# EAGLE design pro-micro-screw-terminal-v1.0 (EAGLE 9.6.2)
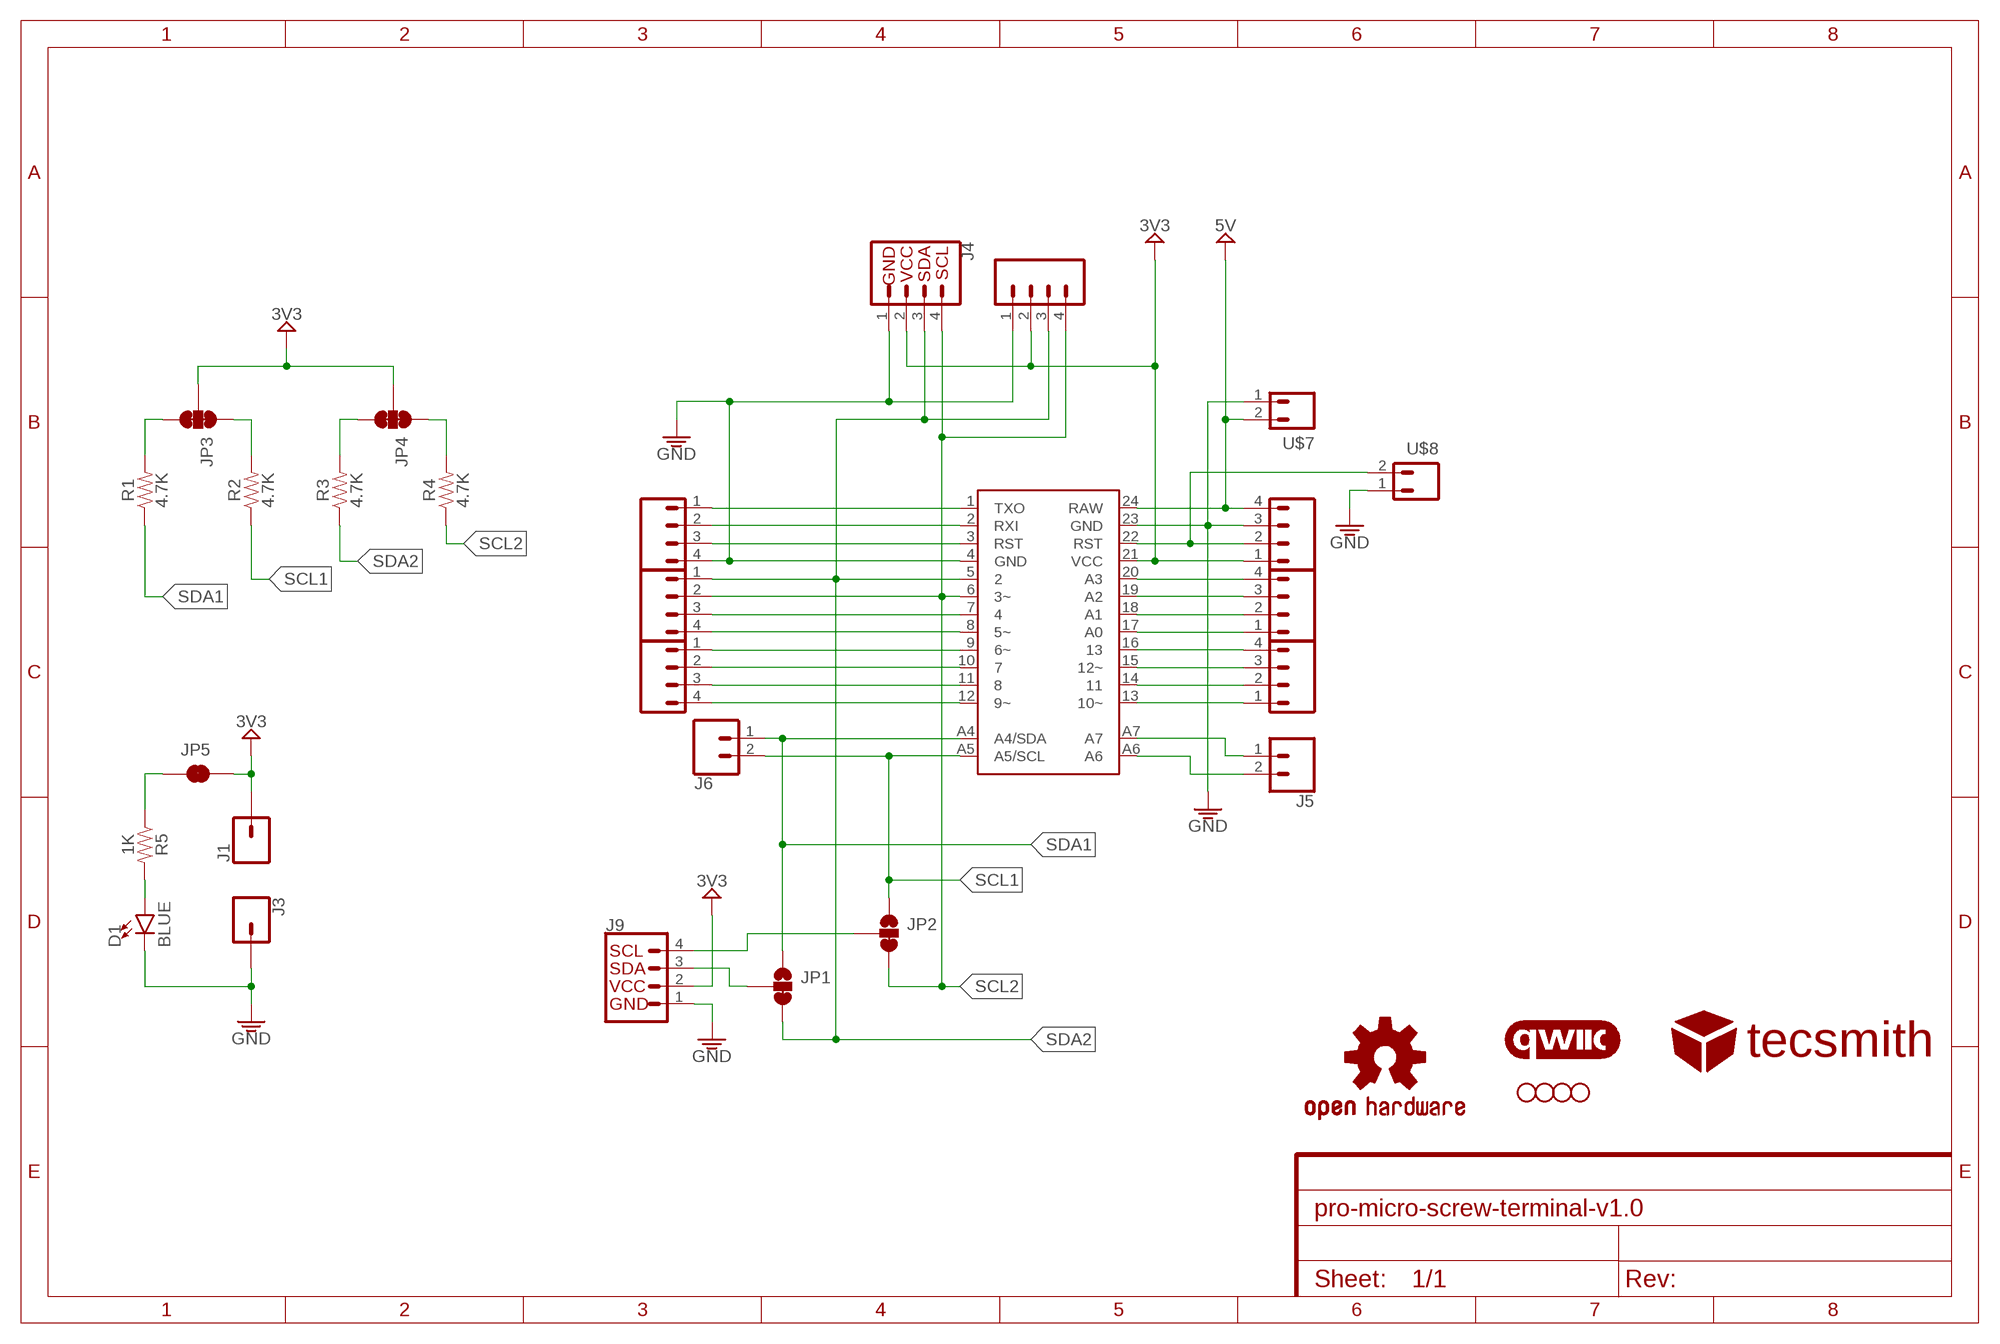
[diagram p0: schematic, sheet 1]

## Parts
B1  ARDUINO_PRO_MININO_FTDI  [ARDUINO_PRO_MINI]
D1  BLUE  LED-BLUE0603  [LED-0603]
H1  STAND-OFF  [STAND-OFF]
H2  STAND-OFF  [STAND-OFF]
H5  STAND-OFF  [STAND-OFF]
H6  STAND-OFF  [STAND-OFF]
J1  CONN_01PTH_NO_SILK_YES_STOP  [1X01_NO_SILK]
J2  CONN_04PTH  [1X04]
J3  CONN_01PTH_NO_SILK_YES_STOP  [1X01_NO_SILK]
J4  QWIIC_RIGHT_ANGLE  QWIIC_CONNECTORJS-1MM  [JST04_1MM_RA]
J5  CONN_02  [1X02]
J6  CONN_02  [1X02]
J9  QWIIC_RIGHT_ANGLE  QWIIC_CONNECTORJS-1MM  [JST04_1MM_RA]
JP1  JUMPER-SMT_3_1-NC_TRACE_SILK  [SMT-JUMPER_3_1-NC_TRACE_SILK]
JP2  JUMPER-SMT_3_1-NC_TRACE_SILK  [SMT-JUMPER_3_1-NC_TRACE_SILK]
JP3  JUMPER-SMT_3_2-NC_TRACE_SILK  [SMT-JUMPER_3_2-NC_TRACE_SILK]
JP4  JUMPER-SMT_3_2-NC_TRACE_SILK  [SMT-JUMPER_3_2-NC_TRACE_SILK]
JP5  JUMPER-SMT_2_NC_TRACE_SILK  [SMT-JUMPER_2_NC_TRACE_SILK]
LOGO1  OSHW-LOGOS  [OSHW-LOGO-S]
LOGO2  QWIIC_LOGO_6MM  [QWIIC_6MM]
R1  4.7K  RESISTOR0805  [0805]
R2  4.7K  RESISTOR0805  [0805]
R3  4.7K  RESISTOR0805  [0805]
R4  4.7K  RESISTOR0805  [0805]
R5  1K  330OHM-0603-1/10W-1%  [0603]
U$1  CON_04SCREW  [WURTH_2431_3.5MM_4X_SCREW]
U$2  CON_04SCREW  [WURTH_2431_3.5MM_4X_SCREW]
U$3  CON_04SCREW  [WURTH_2431_3.5MM_4X_SCREW]
U$4  CON_04SCREW  [WURTH_2431_3.5MM_4X_SCREW]
U$5  CON_04SCREW  [WURTH_2431_3.5MM_4X_SCREW]
U$6  CON_04SCREW  [WURTH_2431_3.5MM_4X_SCREW]
U$7  CON_02SCREW  [WURTH_2431_3.5MM_2X_SCREW]
U$8  JST-PH-2NS  [JST-PH2-NO-SILK]
U$9  TECSMITH-LOGO  [TECSMITH-LOGO]

## Nets
GND: B1.4(GND) B1.23(GND) D1.C J2.1 J3.1 J4.1 J9.1 U$1.4 U$6.3 U$7.1 U$8.1
N$1: B1.1(TXO) U$1.1
N$2: B1.2(RXI) U$1.2
N$3: B1.3(RST) U$1.3
N$4: B1.A7 J5.1
N$5: B1.A6 J5.2
N$6: D1.A R5.2
N$7: B1.7 U$2.3
N$8: B1.8(5~) U$2.4
N$9: B1.9(6~) U$3.1
N$10: B1.10 U$3.2
N$11: B1.11 U$3.3
N$12: B1.12(9~) U$3.4
N$13: JP5.1 R5.1
N$15: B1.22(RST) U$6.2 U$8.2
N$16: JP3.1 R2.2
N$17: B1.20(A3) U$5.4
N$18: B1.19(A2) U$5.3
N$19: B1.18(A1) U$5.2
N$20: B1.17(A0) U$5.1
N$21: B1.16 U$4.4
N$22: B1.15(12~) U$4.3
N$23: B1.14 U$4.2
N$24: B1.13(10~) U$4.1
N$25: JP3.3 R1.2
N$26: JP4.3 R3.2
N$27: JP4.1 R4.2
RAW: B1.24(RAW) U$6.4 U$7.2 ; supply symbol labelled 5V
SCL: J9.4 JP2.2
SCL1: B1.A5(A5/SCL) J6.2 JP2.1 R2.1
SCL2: B1.6(3~) J2.4 J4.4 JP2.3 R4.1 U$2.2
SDA: J9.3 JP1.2
SDA1: B1.A4(A4/SDA) J6.1 JP1.1 R1.1
SDA2: B1.5 J2.3 J4.3 JP1.3 R3.1 U$2.1
VCC: B1.21(VCC) J1.1 J2.2 J4.2 J9.2 JP3.2 JP4.2 JP5.2 U$6.1 ; supply symbol labelled 3V3

## Library data of the parts
B1 = VinoRodrigues_Custom_Eagle:ARDUINO_PRO_MINI: SparkFun Pro Mini Pro Mini compatible footprint. Dimensions: 0.7 x 1.3" PCB Thickness: 0.8mm SparkFun Products: 3.3V/8MHz <https://www.sparkfun.com/products/11114> 5V/16MHz <https://www.sparkfun.com/products/11113>
D1 = SparkFun-LED:LED-BLUE: Blue SMD LED Used in manufacturing of various products at SparkFun Packages: 0603 - SMD 0603 package [Product Link] <http://www.digikey.com/product-detail/en/SMLE12BC7TT86/511-1589-2-ND/1641808> 1206 - SMD1206 package [Product Link] <http://www.digikey.com/product-detail/en/lite-on-inc/LTST-C150TBKT/160-1643-1-ND/573584> SparkFun Products: ESP8266 Thing-Dev Board <https://www.sparkfun.com/products/13711> RedBoard <https://www.sparkfun.com/products/12757>; PROD_ID: DIO-08575
H1 H2 H5 H6 = SparkFun-Hardware:STAND-OFF: Stand Off Drill holes for mechanically mounting via screws, standoffs, etc. Note: Use the keepout ring to avoid running the screw head into surrounding components. Variant Overviews STAND-OFF - Mechanical footprint for a #4 phillips button head screw. STAND-OFF-TIGHT - Mechanical footprint for a #4 phillips button head screw, Example SparkFun Products Screw - Phillips Head (1/4", 4-40, 10 pack) <https://www.sparkfun.com/products/10453> (PRT-10453) Screw - Phillips Head (1/2", 4-40, 10 pack) <https://www.sparkfun.com/products/10452> (PRT-10452) Screw - Phillips Head (3/4", 4-40, 10 pack) <https://www.sparkfun.com/products/10451> (PRT-10451) Screw - Phillips Head (1", 4-40, 10 pack) <https://www.sparkfun.com/products/10450> (PRT-10450)
J1 J3 = SparkFun-Connectors:CONN_01: Single connection point. Often used as Generic Header-pin footprint for 0.1 inch spaced/style header connections On any of the 0.1 inch spaced packages, you can populate with these: Break Away Headers - Straight <https://www.sparkfun.com/products/116> (PRT-00116) Break Away Male Headers - Right Angle <https://www.sparkfun.com/products/553> (PRT-00553) Female Headers <https://www.sparkfun.com/products/115> (PRT-00115) Break Away Headers - Machine Pin <https://www.sparkfun.com/products/117> (PRT-00117) Break Away Female Headers - Swiss Machine Pin <https://www.sparkfun.com/products/743> (PRT-00743) This device is also useful as a general connection point to wire up your design to another part of your project. Our various solder wires solder well into these plated through hole pads. Hook-Up Wire - Assortment (Stranded, 22 AWG) <https://www.sparkfun.com/products/11375> (PRT-11375) Hook-Up Wire - Assortment (Solid Core, 22 AWG) <https://www.sparkfun.com/products/11367> (PRT-11367) View the entire wire category on our website here <https://www.sparkfun.com/categories/141> Special notes: SMTSO-256-ET is a "flush mount" nut for a 4-40 screw. We mostly use this on specialty testbeds; it is a nice way to connect hardware to your PCB at an adjustable hieght. Also note, the SNAP packages are for using a snappable style connector. We sell a baggie of snaps and they are also used on two LilyPad designs: Snap Assortment - 30 pack (male and female) <https://www.sparkfun.com/products/11347> (DEV-11347) LilyPad Arduino SimpleSnap <https://www.sparkfun.com/products/10941> (DEV-10941) LilyPad SimpleSnap Protoboard <https://www.sparkfun.com/products/10940> (DEV-10940)
J2 = SparkFun-Connectors:CONN_04: Multi connection point. Often used as Generic Header-pin footprint for 0.1 inch spaced/style header connections On any of the 0.1 inch spaced packages, you can populate with these: Break Away Headers - Straight <https://www.sparkfun.com/products/116> (PRT-00116) Break Away Male Headers - Right Angle <https://www.sparkfun.com/products/553> (PRT-00553) Female Headers <https://www.sparkfun.com/products/115> (PRT-00115) Break Away Headers - Machine Pin <https://www.sparkfun.com/products/117> (PRT-00117) Break Away Female Headers - Swiss Machine Pin <https://www.sparkfun.com/products/743> (PRT-00743) For SCREWTERMINALS and SPRING TERMINALS visit here: Screw Terimnals on SparkFun.com <https://www.sparkfun.com/search/results?term=Screw+Terminals> (5mm/3.5mm/2.54mm spacing) This device is also useful as a general connection point to wire up your design to another part of your project. Our various solder wires solder well into these plated through hole pads. Hook-Up Wire - Assortment (Stranded, 22 AWG) <https://www.sparkfun.com/products/11375> (PRT-11375) Hook-Up Wire - Assortment (Solid Core, 22 AWG) <https://www.sparkfun.com/products/11367> (PRT-11367) View the entire wire category on our website here <https://www.sparkfun.com/categories/141> Special notes: Molex polarized connector foot print use with SKU : PRT-08231 with associated crimp pins and housings. 1MM SMD Version SKU: PRT-10208; PROD_ID: CONN-09696
J4 J9 = SparkFun-Connectors:QWIIC_CONNECTOR: SparkFun I2C Standard Qwiic Connector An SMD 1mm pitch JST connector makes it easy and quick (get it? Qwiic?) to connect I2C devices to each other. The Qwiic system <http://www.sparkfun.com/qwiic> enables fast and solderless connection between popular platforms and various sensors and actuators. We carry 200mm <https://www.sparkfun.com/products/14204>, 100mm <https://www.sparkfun.com/products/14205>, 50mm <https://www.sparkfun.com/products/14206>, and breadboard friendly <https://www.sparkfun.com/products/14207> Qwiic cables. We also offer 10 pcs strips <https://www.sparkfun.com/products/14323> the SMD connectors.; PROD_ID: CONN-13694
J5 J6 = SparkFun-Connectors:CONN_02: Multi connection point. Often used as Generic Header-pin footprint for 0.1 inch spaced/style header connections On any of the 0.1 inch spaced packages, you can populate with these: Break Away Headers - Straight <https://www.sparkfun.com/products/116> (PRT-00116) Break Away Male Headers - Right Angle <https://www.sparkfun.com/products/553> (PRT-00553) Female Headers <https://www.sparkfun.com/products/115> (PRT-00115) Break Away Headers - Machine Pin <https://www.sparkfun.com/products/117> (PRT-00117) Break Away Female Headers - Swiss Machine Pin <https://www.sparkfun.com/products/743> (PRT-00743) For SCREWTERMINALS and SPRING TERMINALS visit here: Screw Terimnals on SparkFun.com <https://www.sparkfun.com/search/results?term=Screw+Terminals> (5mm/3.5mm/2.54mm spacing) This device is also useful as a general connection point to wire up your design to another part of your project. Our various solder wires solder well into these plated through hole pads. Hook-Up Wire - Assortment (Stranded, 22 AWG) <https://www.sparkfun.com/products/11375> (PRT-11375) Hook-Up Wire - Assortment (Solid Core, 22 AWG) <https://www.sparkfun.com/products/11367> (PRT-11367) View the entire wire category on our website here <https://www.sparkfun.com/categories/141> Special notes: Molex polarized connector foot print use with: PRT-08233 with associated crimp pins and housings. 2.54_SCREWTERM for use with PRT-10571. 3.5mm Screw Terminal footprints for PRT-08084 5mm Screw Terminal footprints for use with PRT-08432
JP1 JP2 = SparkFun-Jumpers:JUMPER-SMT_3_1-NC_TRACE: Normally closed trace jumper (1 of 2 connections) This jumper has a trace between two pads so it's normally closed (NC). The other connection is normally open (NO). Use a razor knife to open the connection. For best results follow the IPC guidelines for cutting traces: Cutout at least 0.063 mm (0.005 in). Remove all loose material to clean up the cut area. Seal the cut with an approved epoxy. Reapply solder to reclose the connection, or to close the NO connection.
JP3 JP4 = SparkFun-Jumpers:JUMPER-SMT_3_2-NC_TRACE: Normally closed trace jumper (2 of 2 connections) This jumper has a trace between all three pads so they are normally closed (NC). Use a razor knife to open the connection(s). For best results follow the IPC guidelines for cutting traces: Cutout at least 0.063 mm (0.005 in). Remove all loose material to clean up the cut area. Seal the cut with an approved epoxy. Reapply solder to reclose the connection(s).
JP5 = SparkFun-Jumpers:JUMPER-SMT_2_NC_TRACE: Normally closed trace jumper This jumper has a trace between two pads so it's normally closed (NC). Use a razor knife to open the connection. For best results follow the IPC guidelines for cutting traces: Cutout at least 0.063 mm (0.005 in). Remove all loose material to clean up the cut area. Seal the cut with an approved epoxy. Reapply solder to reclose the connection.
LOGO1 = SparkFun-Aesthetics:OSHW-LOGO: Open-Source Hardware (OSHW) Logo This logo indicates the piece of hardware it is found on incorporates a OSHW license and/or adheres to the definition of open source hardware found here: http://freedomdefined.org/OSHW
LOGO2 = SparkFun-Aesthetics:QWIIC_LOGO: Qwiic Logos for placement on schematic and PCB. The 5.5mm silk logo is best for placing next to Qwiic connector.
R1-R4 = SparkFun-Resistors:RESISTOR: Generic Resistor Package
R5 = SparkFun-Resistors:330OHM: 330Ω resistor A resistor is a passive two-terminal electrical component that implements electrical resistance as a circuit element. Resistors act to reduce current flow, and, at the same time, act to lower voltage levels within circuits. - Wikipedia; PROD_ID: RES-00818; VALUE: 330
U$1-U$6 = VinoRodrigues_Custom_Eagle:CON_04SCREW
U$7 = VinoRodrigues_Custom_Eagle:CON_02SCREW
U$8 = VinoRodrigues_Custom_Eagle:JST-PH-2
U$9 = VinoRodrigues_Custom_Eagle:TECSMITH-LOGO

## Board
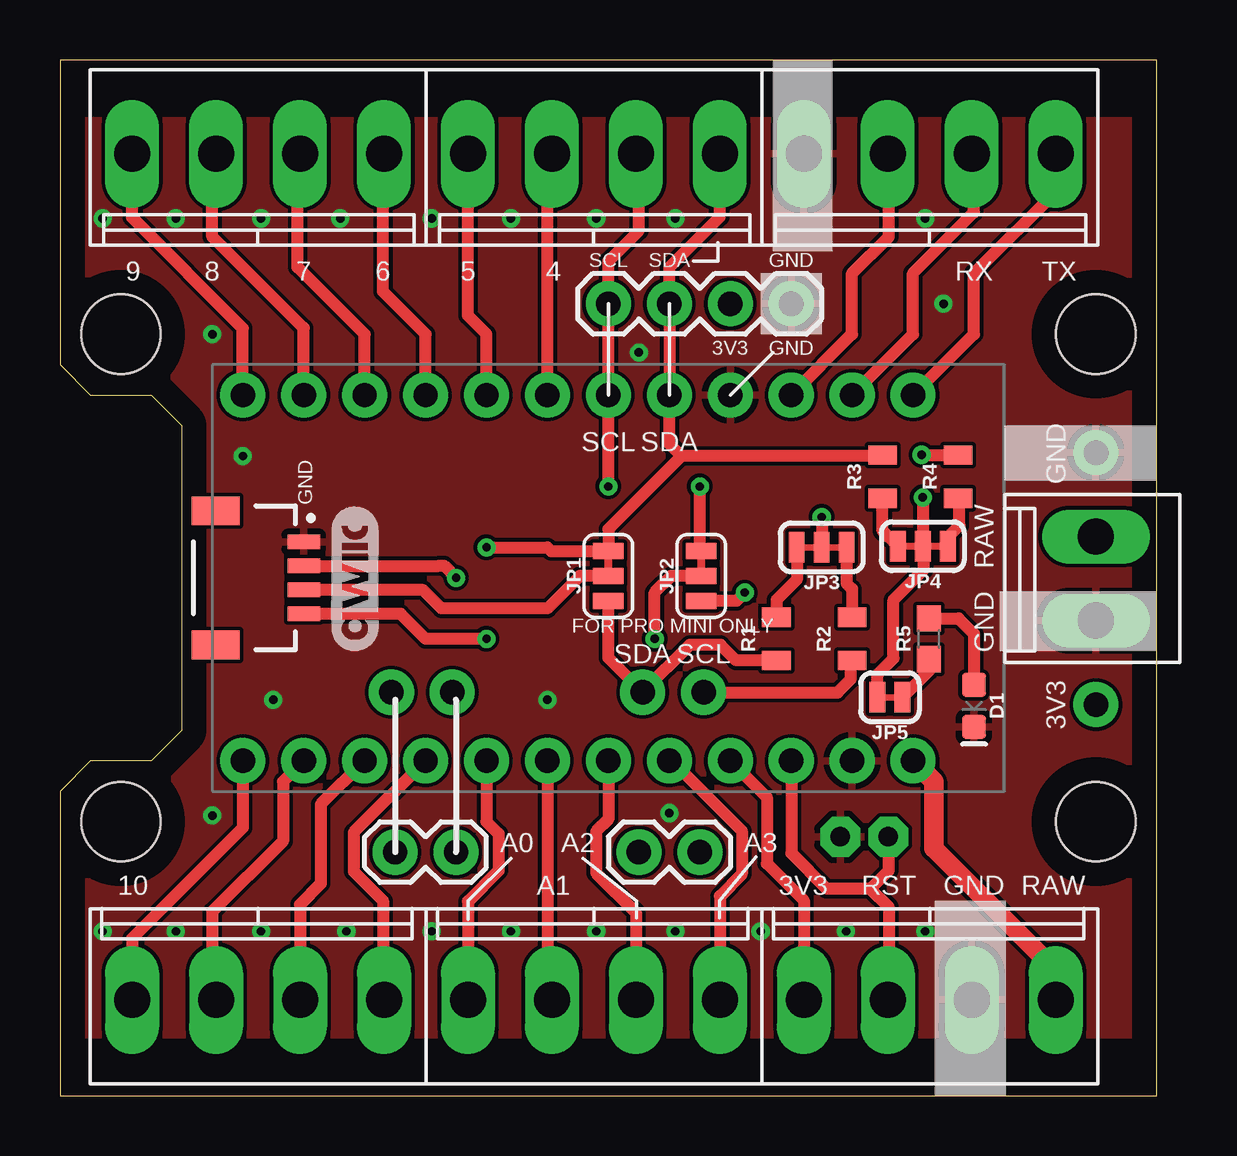
[diagram p1: board, top side]
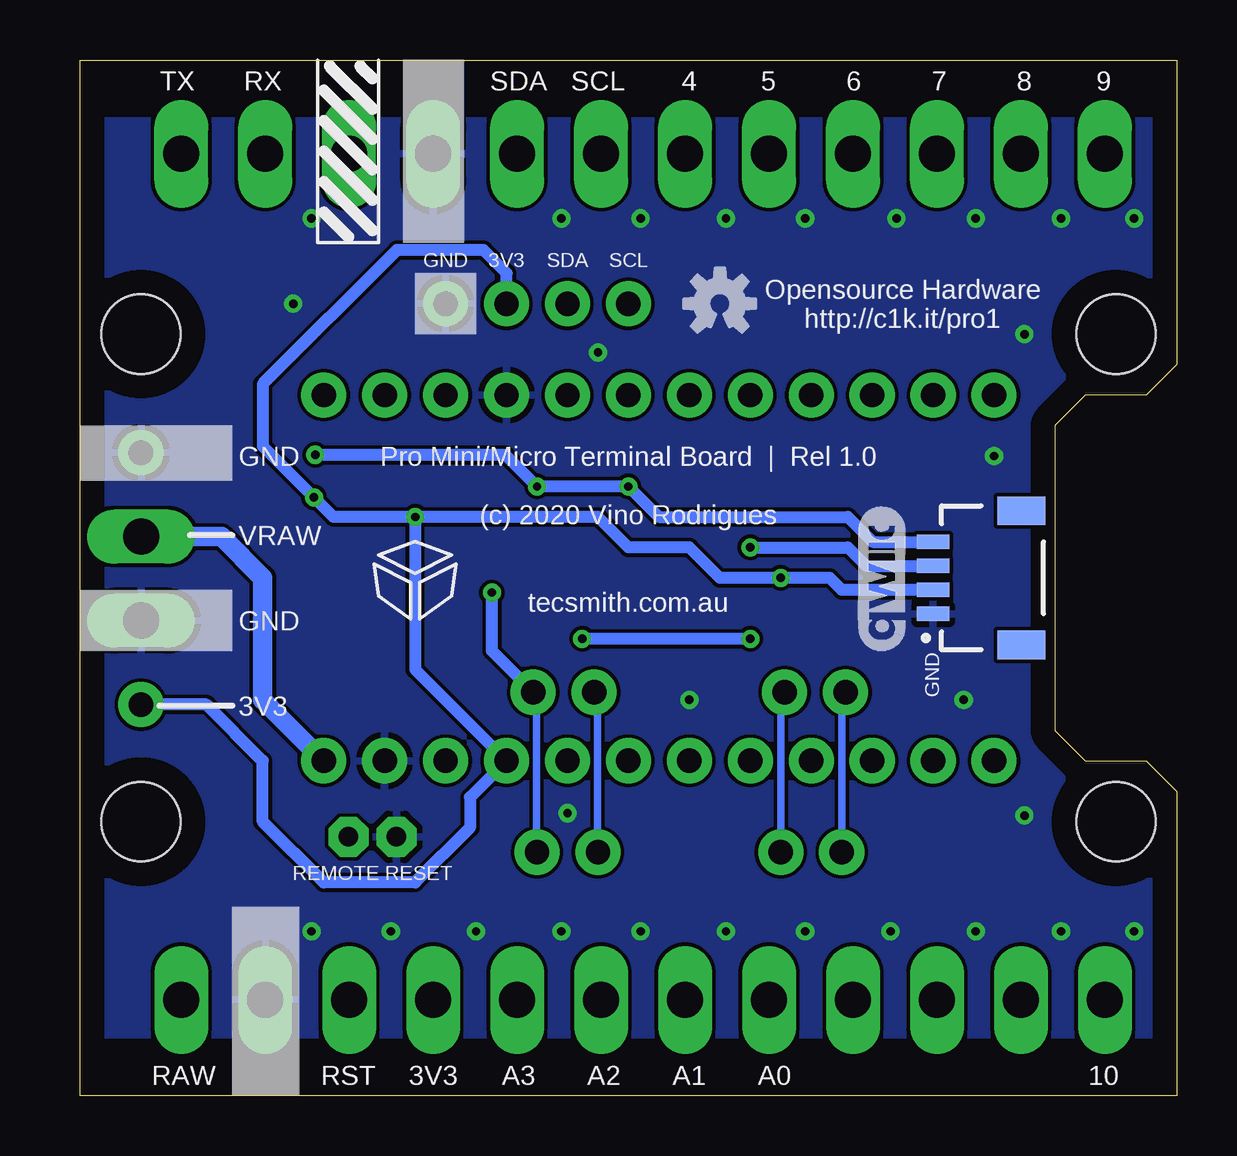
[diagram p2: board, bottom side, seen from below]

Size 45.72 x 43.18 mm. Coordinates in mm from the lower left corner, seen from the top.
Outline: 0,0 45.72,0 45.72,43.18 0,43.18 0,30.48 1.27,29.21 3.81,29.21 5.08,27.94 5.08,15.24 3.81,13.97 1.27,13.97 0,12.7 0,0
Copper layers (1*16): Top 0.035mm / dielectric 1.5mm / Bottom 0.035mm
Design rules "default": minimum track width 6mil, minimum drill 0.35mm, track to track 6mil, track to pad 6mil, pad to pad 6mil, via to via 6mil, smd to smd 6mil, copper to edge 40mil, drill to drill 6mil, minimum pad ring 10mil, minimum via ring 8mil, stop-mask expansion 4mil, vias tented up to drill 0mil, thermal gap 10mil

### Footprints (pad centres in the part's own frame; a part is rotated, then mirrored left to right if it is on the bottom)
ARDUINO_PRO_MINI = drill 1.016 pad 1.88: 1 -7.62,12.7; 2 -7.62,10.16; 3 -7.62,7.62; 4 -7.62,5.08; 5 -7.62,2.54; 6 -7.62,0; 7 -7.62,-2.54; 8 -7.62,-5.08; 9 -7.62,-7.62; 10 -7.62,-10.16; 11 -7.62,-12.7; 12 -7.62,-15.24; 13 7.62,-15.24; 14 7.62,-12.7; 15 7.62,-10.16; 16 7.62,-7.62; 17 7.62,-5.08; 18 7.62,-2.54; 19 7.62,0; 20 7.62,2.54; 21 7.62,5.08; 22 7.62,7.62; 23 7.62,10.16; 24 7.62,12.7; A4 4.763,1.429; A5 4.763,3.969; A6 4.763,-9.049; A7 4.763,-6.509
LED-0603 = smd 1 x 1: A -0.877,0; C 0.877,0
STAND-OFF = hole 3.302: 0,0
1X01_NO_SILK = drill 1.016 pad 1.88: 1 0,0
1X04 = drill 1.016 pad 1.88: 1 0,0; 2 2.54,0; 3 5.08,0; 4 7.62,0
JST04_1MM_RA = smd 0.6 x 1.35: 1 -1.5,0; 2 -0.5,0; 3 0.5,0; 4 1.5,0 | smd 1.2 x 2: NC1 2.8,-3.675; NC2 -2.8,-3.675
1X02 = drill 1.016 pad 1.88: 1 0,0; 2 2.54,0
SMT-JUMPER_3_1-NC_TRACE_SILK = smd 0.66 x 1.27: 1 -1.041,0; 2 0,0; 3 1.041,0
SMT-JUMPER_3_2-NC_TRACE_SILK = smd 0.66 x 1.27: 1 -1.041,0; 2 0,0; 3 1.041,0
SMT-JUMPER_2_NC_TRACE_SILK = smd 0.66 x 1.27: 1 -0.521,0; 2 0.521,0
0805 = smd 0.8 x 1.2: 1 -0.9,0; 2 0.9,0
0603 = smd 1.1 x 1: 1 -0.85,0; 2 0.85,0
WURTH_2431_3.5MM_4X_SCREW = drill 1.5 long: 1 0,0; 2 3.5,0; 3 7,0; 4 10.5,0
WURTH_2431_3.5MM_2X_SCREW = drill 1.5 long: 1 0,0; 2 3.5,0
JST-PH2-NO-SILK = drill 0.813 pad 1.676 octagon: 1 1,0; 2 -1,0

### Placement (x,y rotation side)
B1  22.86,21.59 270 top
D1  38.1,16.26 270 top
H1  2.54,31.75 0 top
H2  43.18,31.75 0 top
H5  2.54,11.43 0 top
H6  43.18,11.43 0 top
J1  43.18,16.31 0 top
J2  30.48,33.02 180 top
J3  43.18,26.81 0 top
J4  10.16,21.59 90 bottom
J5  16.51,10.16 180 top
J6  24.13,10.16 0 top
J9  10.16,21.59 270 top
JP1  22.86,21.68 90 top
JP2  26.73,21.68 90 top
JP3  31.75,22.86 180 top
JP4  35.97,22.91 180 top
JP5  34.59,16.61 180 top
LOGO1  19.05,33.02 0 bottom
LOGO2  12.29,21.59 90 top
LOGO3  QWIIC_LOGO_6MM  [QWIIC_6MM]  12.29,21.59 90 bottom
R1  29.87,19.05 90 top
R2  33.02,19.05 90 top
R3  34.29,25.81 270 top
R4  37.44,25.81 270 top
R5  36.22,19.05 90 top
U$1  41.5,39.27 180 top
U$2  27.5,39.27 180 top
U$3  13.5,39.27 180 top
U$4  3,4 0 top
U$5  17,4 0 top
U$6  31,4 0 top
U$7  43.18,19.81 90 top
U$8  33.53,10.79 180 top
U$9  31.75,21.59 0 bottom

### Tracks (layer width: path | path; a pad name or v marks a point on that pad's centre or on a via)
GND  (via drill 0.35)
  other vias: 8.89,16.51 20.32,16.51 4.83,36.58 8.38,36.58 11.68,36.58 15.49,36.58 18.8,36.58 22.35,36.58 25.65,36.58 36.07,36.58 36.83,33.02 6.35,31.75 7.62,26.67 4.83,6.86 8.38,6.86 11.94,6.86 15.49,6.86 18.8,6.86 22.35,6.86 25.65,6.86 29.21,6.86 32.77,6.86 36.07,6.86 1.78,6.86 1.78,36.58 6.35,11.68 24.13,30.99 25.4,11.79
  pour Bottom: 0,2.54 45.72,2.54 45.72,40.64 0,40.64 0,30.48 1.27,29.21 3.81,29.21 5.08,27.94 5.08,15.24 3.81,13.97 1.27,13.97 0,12.7
  pour Top: 0,2.54 45.72,2.54 45.72,40.64 0,40.64 0,30.48 1.27,29.21 3.81,29.21 5.08,27.94 5.08,15.24 3.81,13.97 1.27,13.97 0,12.7
N$1
  Top 0.508: B1.1 38.1,31.75 38.1,34.29 41.66,37.85 41.66,39.11 U$1.1
N$2
  Top 0.508: B1.2 35.56,31.75 35.56,34.29 38.1,36.83 38.1,39.17 U$1.2
N$3
  Top 0.508: B1.3 33.02,31.75 33.02,34.29 34.54,35.81 34.54,39.23 U$1.3
N$4
  Bottom 0.305: B1.A7 16.51,16.67 J5.1
N$5
  Bottom 0.305: B1.A6 13.97,16.67 J5.2
N$6
  Top 0.508: R5.2 37.45,19.9 38.1,19.25 D1.A
N$7
  Top 0.508: U$2.3 20.32,39.09 B1.7
N$8
  Top 0.508: U$2.4 17,32.53 17.78,31.75 B1.8
N$9
  Top 0.508: B1.9 15.24,31.75 13.46,33.53 13.46,39.23 U$3.1
N$10
  Top 0.508: B1.10 12.7,31.75 9.91,34.54 9.91,39.18 U$3.2
N$11
  Top 0.508: B1.11 10.16,32 6.35,35.81 6.35,39.12 U$3.3
N$12
  Top 0.508: B1.12 7.62,32 3,36.62 U$3.4
N$13
  Top 0.508: JP5.1 36.22,17.72 R5.1
N$15
  Top 0.508: B1.22 30.48,10.11 31.95,8.64 33.78,8.64 | 33.78,8.64 34.54,7.87 34.54,4.04 U$6.2 | 33.78,8.64 34.54,9.4 34.54,10.78 U$8.2
N$16
  Top 0.508: JP3.1 32.79,21.36 33.02,21.13 R2.2
N$17
  Top 0.508: U$5.4 27.5,8.32 28.42,9.25 28.42,11.05 25.5,13.97 B1.20
N$18
  Top 0.508: B1.19 22.86,11.53 22.35,11.02 22.35,9.3 24,7.65 U$5.3
N$19
  Top 0.508: B1.18 20.32,4.18 U$5.2
N$20
  Top 0.508: B1.17 17.78,11.43 18.29,10.92 18.29,9.4 17,8.11 U$5.1
N$21
  Top 0.508: U$4.4 13.46,4.04 13.46,8.13 12.24,9.35 12.24,10.97 B1.16
N$22
  Top 0.508: U$4.3 10,7.98 10.87,8.85 10.87,12.14 B1.15
N$23
  Top 0.508: B1.14 9.3,13.11 9.3,10.62 6.35,7.67 6.35,4.15 U$4.2
N$24
  Top 0.508: B1.13 7.62,11.18 3,6.56 U$4.1
N$25
  Top 0.508: JP3.3 30.71,21.51 29.87,20.68 R1.2
N$26
  Top 0.508: JP4.3 34.29,23.55 R3.2
N$27
  Top 0.508: JP4.1 37.01,23.29 37.49,23.77 37.49,24.86 R4.2
RAW
  Top 0.813: B1.24 36.42,13.11 36.42,10.31 41.5,5.24 U$6.4
  Bottom 0.813: U$7.2 39.82,23.31 38.1,21.59 38.1,16.51 B1.24
SCL  (via drill 0.35)
  Top 0.508: JP2.2 25.49,21.68 24.79,20.98 v24.79,19.05 | v17.78,19.05 15.24,19.05 14.2,20.09 J9.4
  Bottom 0.508: v17.78,19.05 v24.79,19.05
SCL1  (via drill 0.35)
  Top 0.508: R2.1 32.97,18.1 32.97,17.37 32.41,16.82 26.84,16.82 B1.A5 | v28.55,20.98 28.2,20.64 JP2.1
  Bottom 0.305: B1.A5 26.7,16.69 26.7,10.19 J6.2
  Bottom 0.508: B1.A5 28.55,18.55 v28.55,20.98
SCL2  (via drill 0.35)
  Top 0.508: U$2.2 24.13,39.14 24.13,36.07 22.86,34.8 J2.4 B1.6 v22.86,25.4 | v35.92,26.72 37.45,26.72 R4.1 | JP2.3 26.67,22.78 v26.67,25.4
  Bottom 0.508: J4.4 12.68,23.09 13.72,24.13 21.59,24.13 v22.86,25.4 v26.67,25.4 27.99,26.72 v35.92,26.72
SDA
  Top 0.508: JP1.2 21.68,21.68 20.32,20.32 15.9,20.32 15.14,21.08 J9.3
SDA1
  Top 0.508: JP1.1 22.86,18.26 B1.A4 26.26,18.8 27.53,18.8 28.18,18.15 R1.1
  Bottom 0.305: B1.A4 24.16,16.69 24.16,10.19 J6.1
SDA2  (via drill 0.35)
  Top 0.508: U$2.1 27.5,36.64 25.4,34.54 J2.3 B1.5 25.4,27.18 25.91,26.67 | 22.86,22.79 22.86,23.62 25.91,26.67 | 22.86,22.79 JP1.3 | v17.78,22.86 20.32,22.86 20.47,22.71 22.47,22.71 22.56,22.79 22.86,22.79 | R3.1 34.25,26.67 25.91,26.67
  Bottom 0.508: J4.3 12.95,22.09 13.72,22.86 v17.78,22.86
VCC  (via drill 0.35)
  Top 0.508: v31.75,24.13 JP3.2 | J9.2 15.79,22.09 15.8,22.1 16,22.1 v16.51,21.59 | v35.97,24.94 JP4.2 36.02,22.86 36.02,21.95 34.75,20.68 34.75,18.24 34.07,17.56 JP5.2 | B1.21 29.46,12.45 29.46,9.68 31,8.15 U$6.1
  Bottom 0.508: J1.1 40.44,16.31 38.1,13.97 38.1,11.43 35.56,8.89 31.75,8.89 29.46,11.18 29.46,12.45 B1.21 31.75,17.78 v31.75,24.13 | J4.2 13.97,21.09 14.47,21.59 v16.51,21.59 19.05,21.59 20.32,22.86 22.86,22.86 24.13,24.13 v31.75,24.13 | J2.2 27.94,34.29 28.91,35.26 32.51,35.26 38.1,29.67 38.1,27.08 v35.97,24.94 35.15,24.13 v31.75,24.13

### Text on the board
bPlace: Opensource Hardware / http://c1k.it/pro1 | Pro Mini/Micro Terminal Board | Rel 1.0 / / (c) 2020 Vino Rodrigues / / / tecsmith.com.au
tNames: 9 | 8 | 7 | 6 | 5 | 4 | SCL | SDA | GND | RX | TX | 3V3 | GND | SCL | SDA | GND | GND | RAW | GND | FOR PRO MINI ONLY | SDA | SCL | 3V3 | A0 | A2 | A3 | 10 | A1 | 3V3 | RST | GND | RAW
bNames: 9 | 8 | 7 | 6 | 5 | 4 | SCL | SDA | RX | TX | SCL | SDA | 3V3 | GND | GND | VRAW | GND | GND | 3V3 | REMOTE RESET | 10 | A0 | A1 | A2 | A3 | 3V3 | RST | RAW